# Altium schematic sheet Power.SchDoc
size A; SheetNumber: 4; SheetTotal: 5
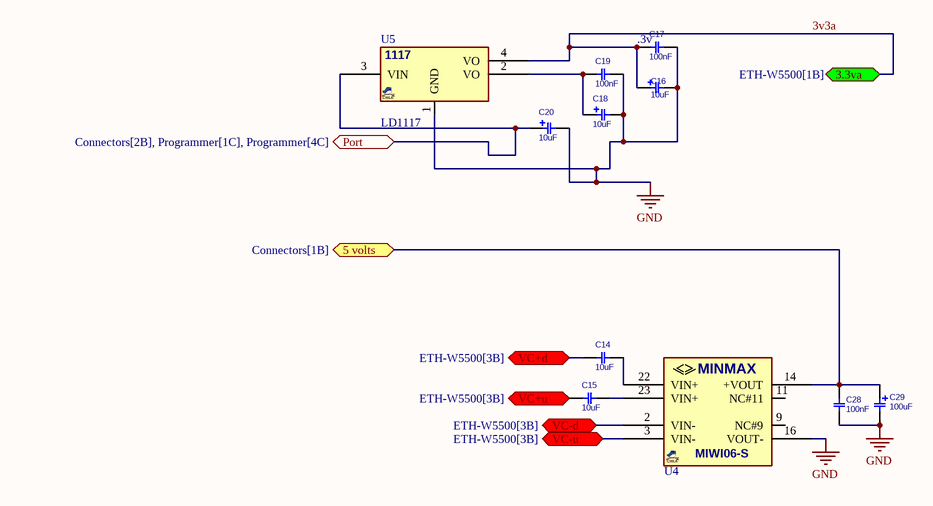
[diagram p0: Power.SchDoc]

## Parts
C14  10uF  [C_CERM_D3]
C15  10uF  [C_CERM_D3]
C16  10uF  [C_EL_4X7]
C17  100nF  [C_CERM_D3]
C18  10uF  [C_EL_4X7]
C19  100nF  [C_CERM_D3]
C20  10uF  [C_EL_4X7]
C28  100nF  [C_CERM_D3]
C29  100uF  [C_EL_4X7]
U4  MIWI06-24S05  [MINMAX_MIW6]  (value not drawn)
U5  LD1117  [SOT223_4]

## Ports
3.3va (bidir, see ETH-W5500[1B]), 5 volts (bidir, see Connectors[1B]), Port (bidir, see Connectors[2B], Programmer[1C], Programmer[4C]), VC+d (bidir, see ETH-W5500[3B]), VC+u (bidir, see ETH-W5500[3B]), VC-d (bidir, see ETH-W5500[3B]), VC-u (bidir, see ETH-W5500[3B])

## Nets
GND: C16.2 C17.2 C18.2 C19.2 C20.2 C28.1 C29.2 U4.16(VOUT-) U5.1(GND)
3v3a: C16.1 C17.1 U5.4(VO) ; port 3.3va
5 volts: C28.2 C29.1 U4.14(+VOUT) ; port 5 volts
Port: C20.1 U5.3(VIN) ; port Port
VC+d: C14.2 ; port VC+d
VC+u: C15.2 ; port VC+u
VC-d: U4.2(VIN-) ; port VC-d
VC-u: U4.3(VIN-) ; port VC-u
NetC14_1: C14.1 U4.22(VIN+)
NetC15_1: C15.1 U4.23(VIN+)
NetC18_1: C18.1 C19.1 U5.2(VO)

Not connected (* = marked no-connect by the designer): U4 9(NC#9) 11(NC#11)

## Notes on the sheet
- (near C17) .3v
- (in symbol MIWI06-48S05) MINMAX; MIWI06-S
- (in symbol VREG_1117_SOT223) 1117

## Library data of the parts
C14 C15 C17 C19 C28 = CAP_THD_CER: CAP, THD, CER MULTI LAYER,; DESC: CAP, CER MULTI LAYER,; MANF_P#: MANF_PART#; PARAM2: 50V; PRICE: 100= 1$; MANF: MANF; ASSEMBLY: ASSEMBLY
  C14 C15: VALUE: 10uF
  C17 C19 C28: VALUE: 100nF
C16 C18 C20 C29 = CAP_THD_EL_10u25V: CAP, THD, ELEC, 10uF, 25V; MANF_P#: MANF_PART#; PARAM: 25V; MANF: MANF; PARAM2: PARAM2
  C16 C18 C20: VALUE: 10uF
  C29: VALUE: 100uF
U4 = MIWI06-48S05: DC-DC Converter, Isolated, 6W; MANF: MinMax; PARAM2: 18~75(48)Vin, 5Vout, 6W; PARAM: 1200mA, -40~85°C; DESC: https://www.minmax.com.tw/en/download/files/1673/MIWI06_Datasheet.pdf; MANF_P#: MIWI06-24S05; VALUE: MIWI06-24S05
U5 = VREG_1117_SOT223: REG, Linear, LDO1V, 0.8A, SOT-223; MANF_P#: LD1117, LM1117, AMS1117, TLV1117, REG1117, NCP1117, LT1117, SPX1117; MANF: TI, ON, ST; PARAM2: 1.2/1.5/1.8/2.5/2.85/3.3/5V; PARAM: LDO1V, 0.8A; VALUE: LD1117